# EAGLE schematic MotorsteuerungKlein (EAGLE 9.5.1)
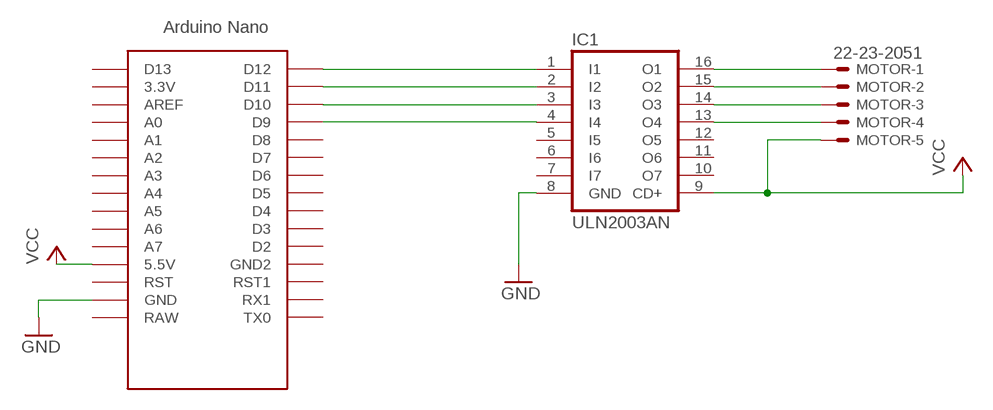
[diagram p0: schematic, sheet 1]

## Parts
IC1  ULN2003AN  [DIL16]
MOTOR  22-23-2051  [22-23-2051]
U$1  NANO  [NANO]

## Nets
GND: IC1.8(GND) U$1.GND
N$1: IC1.16(O1) MOTOR.1
N$2: IC1.1(I1) U$1.D12
N$3: IC1.2(I2) U$1.D11
N$4: IC1.3(I3) U$1.D10
N$5: IC1.4(I4) U$1.D9
N$6: IC1.15(O2) MOTOR.2
N$7: IC1.14(O3) MOTOR.3
N$8: IC1.13(O4) MOTOR.4
VCC: IC1.9(CD+) MOTOR.5 U$1.5V(5.5V)
Unconnected: IC1.5(I5) IC1.6(I6) IC1.7(I7) IC1.10(O7) IC1.11(O6) IC1.12(O5) U$1.3.3V U$1.A0 U$1.A1 U$1.A2 U$1.A3 U$1.A4 U$1.A5 U$1.A6 U$1.A7 U$1.AREF U$1.D2 U$1.D3 U$1.D4 U$1.D5 U$1.D6 U$1.D7 U$1.D8 U$1.D13 U$1.GND1(GND2) U$1.ICSP1 U$1.ICSP2 U$1.ICSP3 U$1.ICSP4 U$1.ICSP5 U$1.ICSP6 U$1.RAW U$1.RST U$1.RST1 U$1.RX1 U$1.TX0

## Library data of the parts
IC1 = uln-udn:ULN2003A: DRIVER ARRAY
MOTOR = con-molex:22-23-2051: .100" (2.54mm) Center Header - 5 Pin; MF: MOLEX; MPN: 22-23-2051; OC_FARNELL: 1462952; OC_NEWARK: 38C9178
U$1 = Arduino-clone:NANO: Arduino Nano